# EAGLE schematic tm4cShield_v2.0 (EAGLE 8.0.0)
CNAME: ARL; DESIGNER: Shriya Shah

## Sheet 1 of 2: Power Input, Conditioning
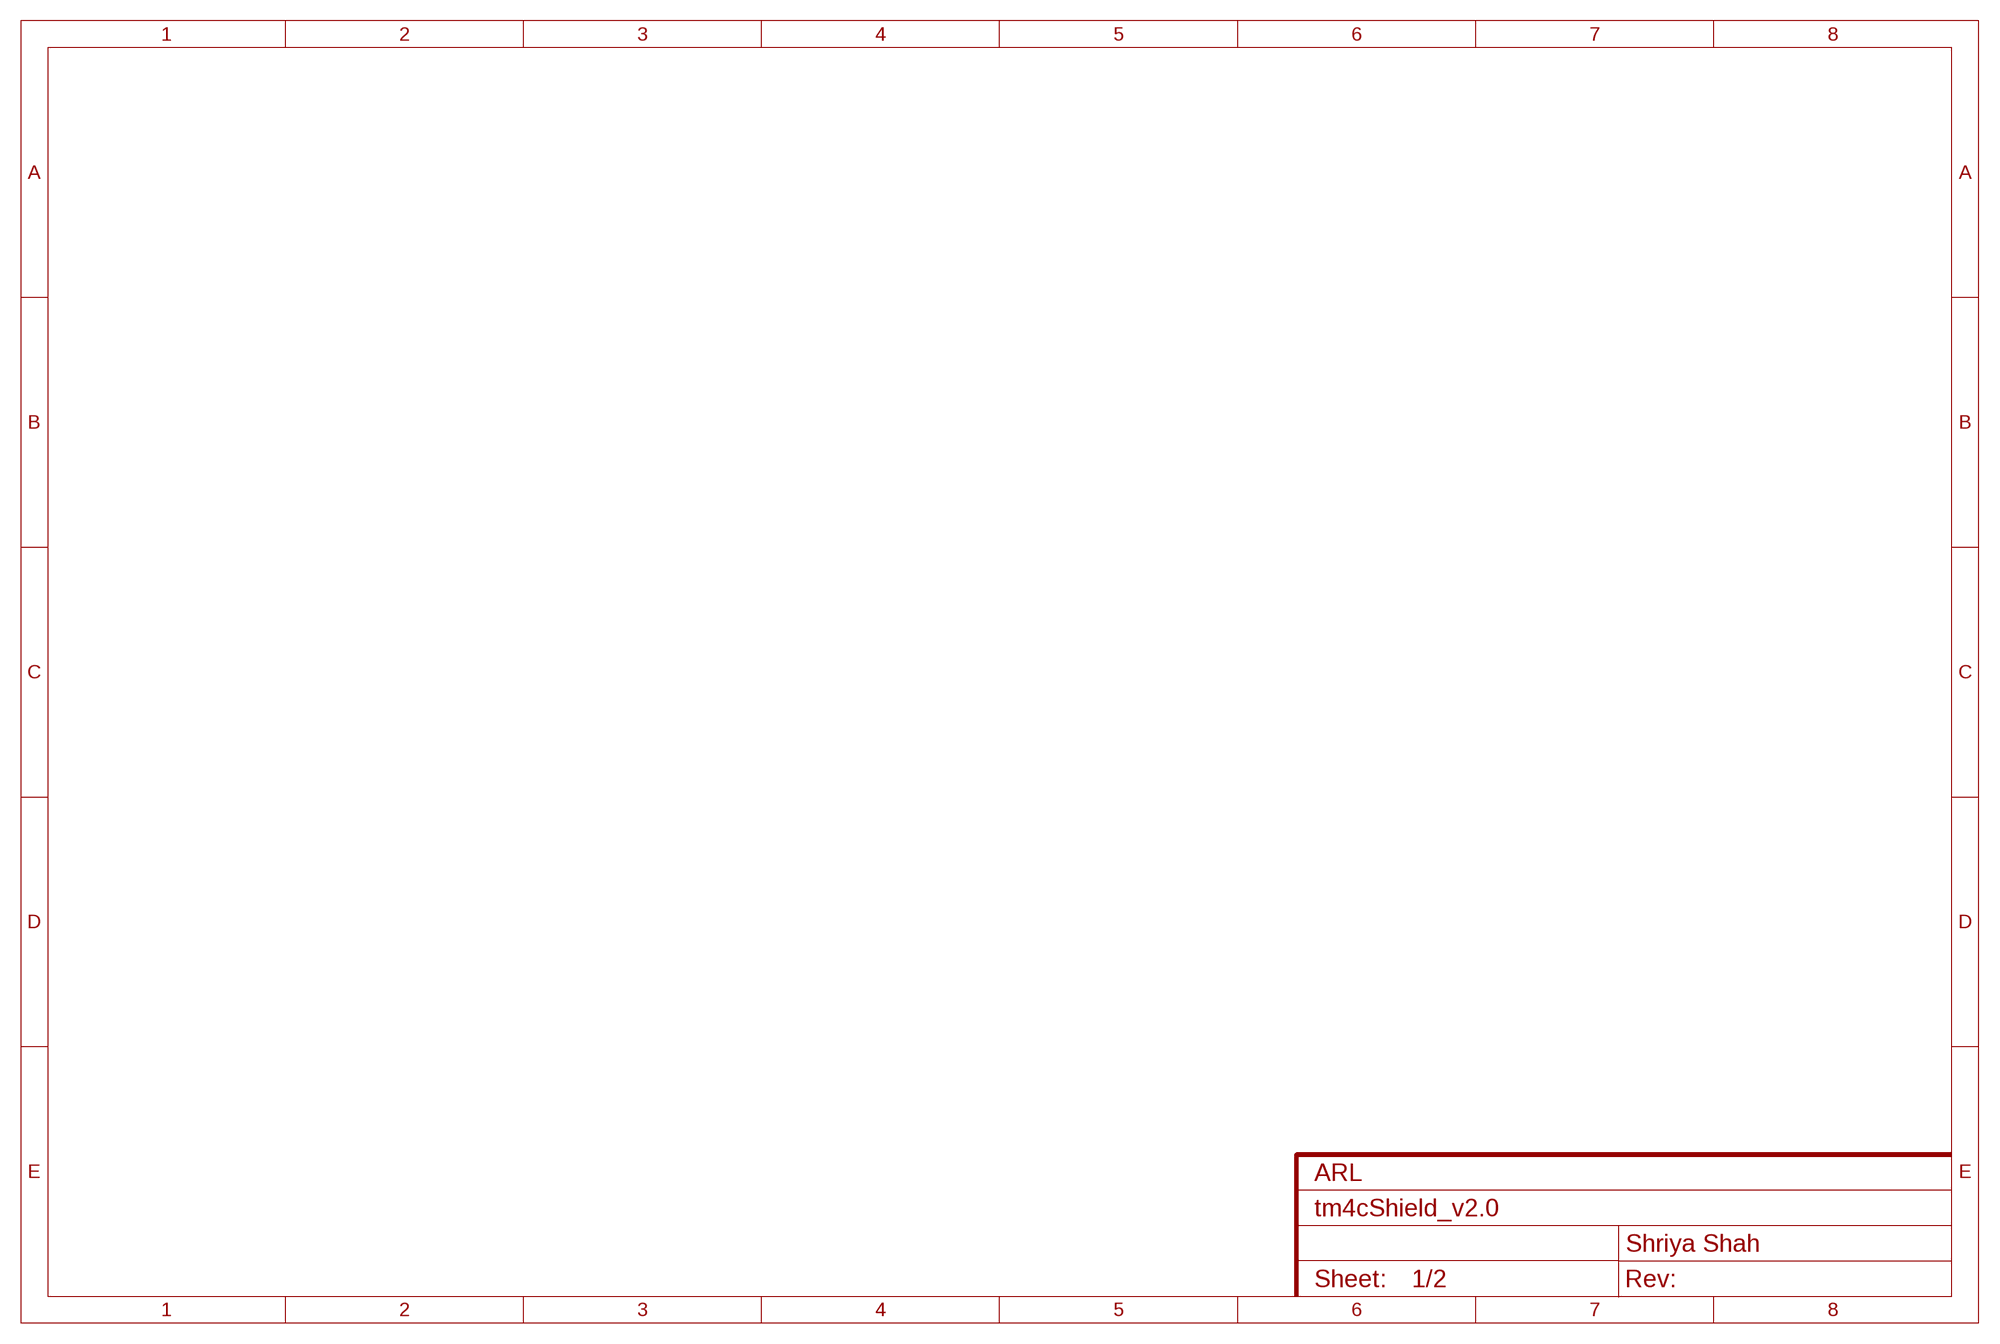
[diagram p0: schematic, sheet 1]

## Sheet 2 of 2
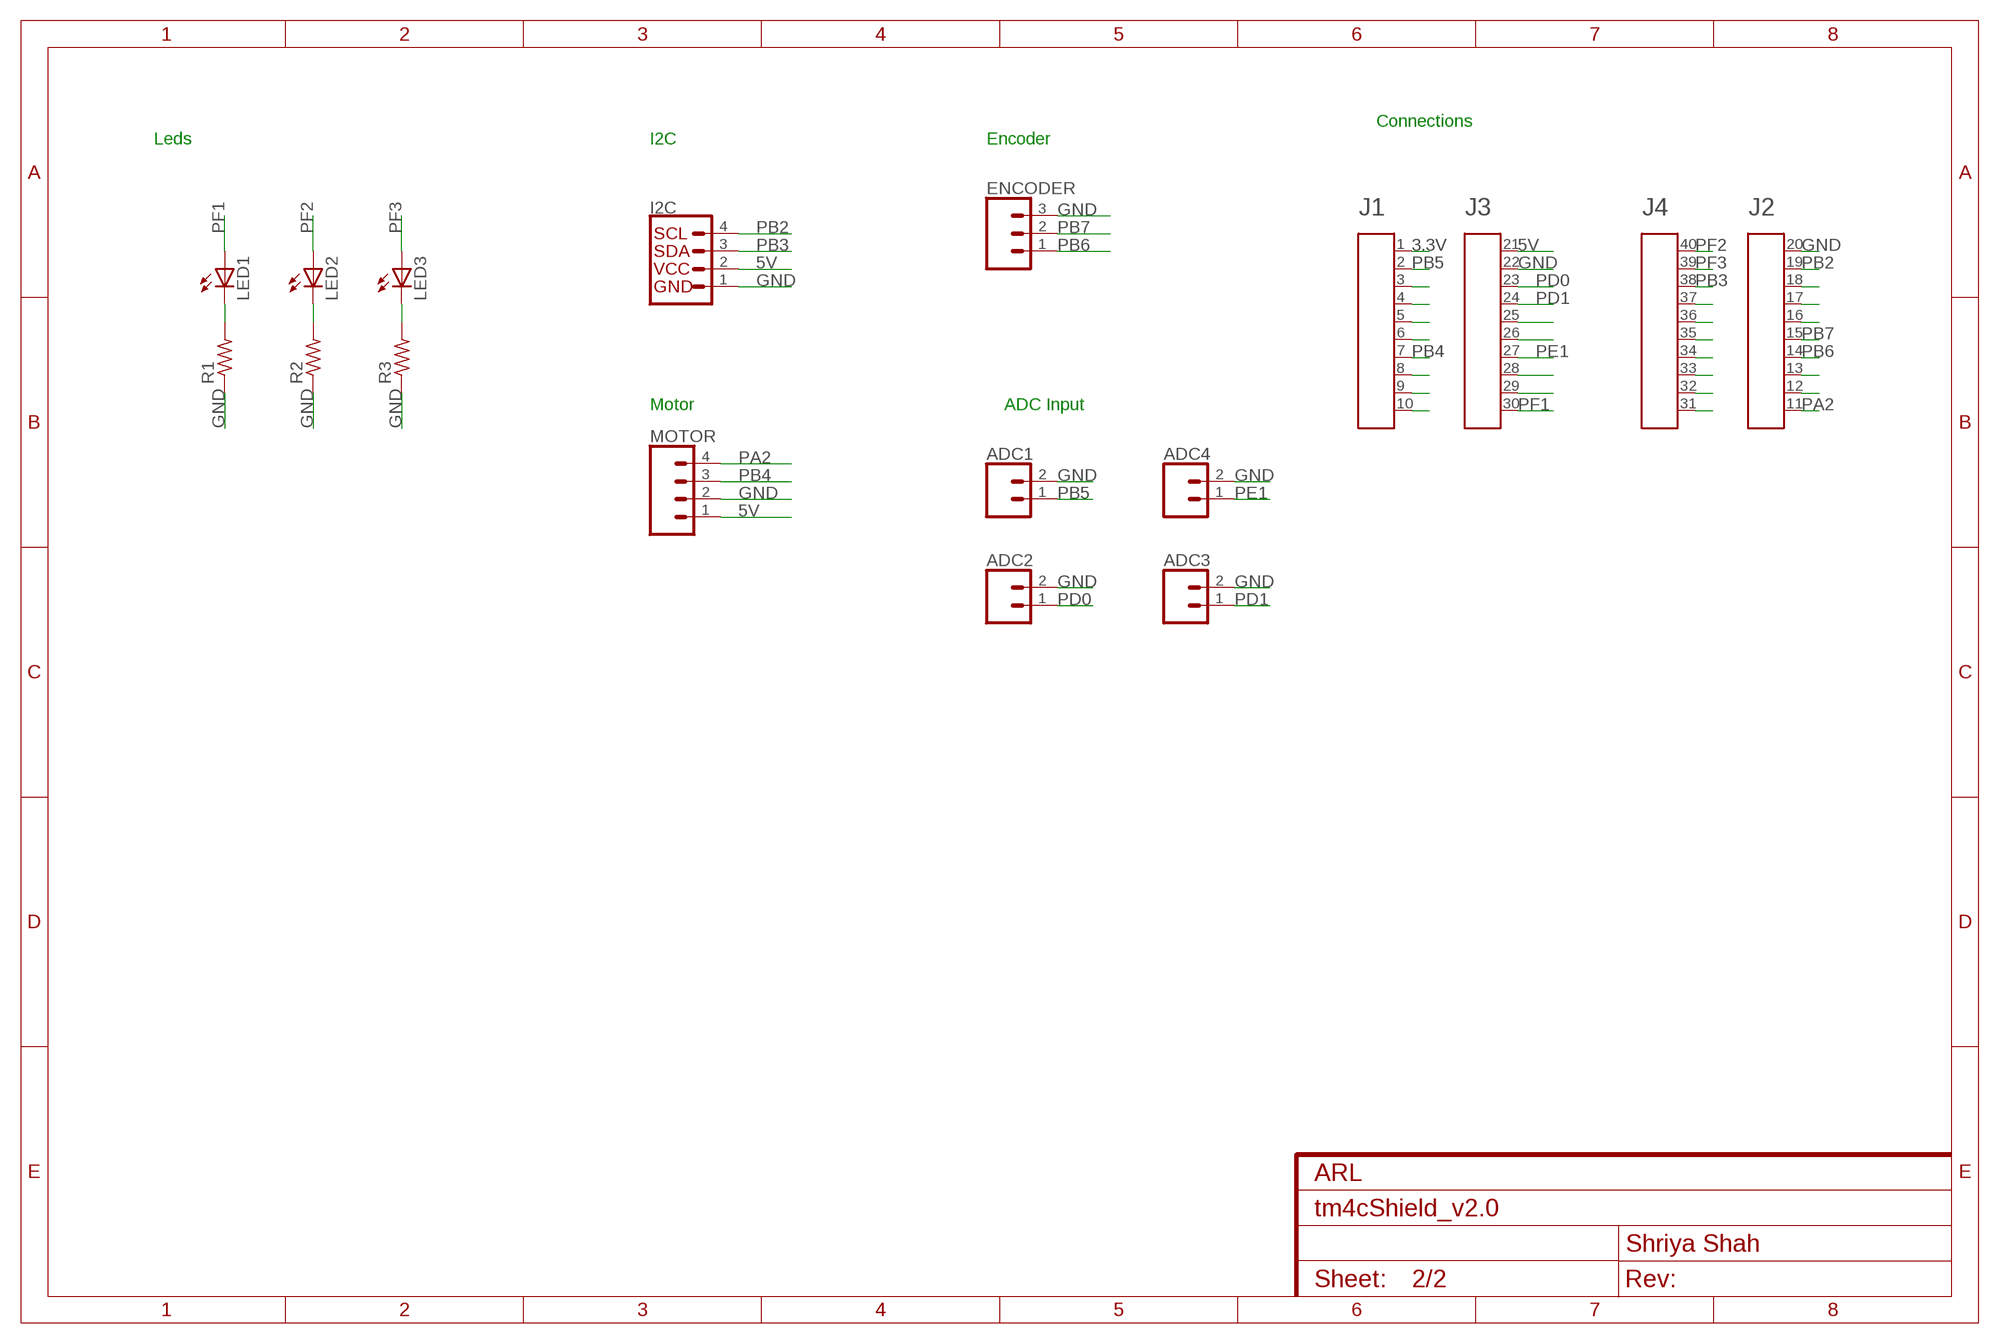
[diagram p1: schematic, sheet 2]

### Parts
A1  HEADER4X10-BOOSTERPACK  [4X10-BOOSTERPACK]
ADC1  CONN_02  [1X02]
ADC2  CONN_02  [1X02]
ADC3  CONN_02  [1X02]
ADC4  CONN_02  [1X02]
ENCODER  CONN_03JST-PTH-VERT  [JST-3-PTH-VERT]
I2C  I2C_STANDARD  [1X04]
LED1  LED0603  [LED-0603]
LED2  LED0603  [LED-0603]
LED3  LED0603  [LED-0603]
MOTOR  CONN_04JST-PTH-VERT  [JST-4-PTH-VERT]
R1  RESISTOR_0603  [RESC0603]
R2  RESISTOR_0603  [RESC0603]
R3  RESISTOR_0603  [RESC0603]

### Nets
3.3V: A1.1
5V: A1.21 I2C.2 MOTOR.1
GND: A1.20 A1.22 ADC1.2 ADC2.2 ADC3.2 ADC4.2 ENCODER.3 I2C.1 MOTOR.2 R1.1 R2.1 R3.1
N$2: LED1.C R1.2
N$4: A1.3
N$5: A1.4
N$6: LED2.C R2.2
N$7: LED3.C R3.2
N$8: A1.5
N$9: A1.6
N$11: A1.8
N$12: A1.9
N$13: A1.10
N$18: A1.25
N$19: A1.26
N$21: A1.28
N$22: A1.29
N$27: A1.37
N$28: A1.36
N$29: A1.35
N$30: A1.34
N$31: A1.33
N$32: A1.32
N$33: A1.31
N$36: A1.18
N$37: A1.17
N$38: A1.16
N$41: A1.13
N$42: A1.12
PA2: A1.11 MOTOR.4
PB2: A1.19 I2C.4
PB3: A1.38 I2C.3
PB4: A1.7 MOTOR.3
PB5: A1.2 ADC1.1
PB6: A1.14 ENCODER.1
PB7: A1.15 ENCODER.2
PD0: A1.23 ADC2.1
PD1: A1.24 ADC3.1
PE1: A1.27 ADC4.1
PF1: A1.30 LED1.A
PF2: A1.40 LED2.A
PF3: A1.39 LED3.A

### Notes on the sheet
- Connections
- Leds | I2C | Encoder
- Motor | ADC Input

## Library data of the parts
A1 = EAGLE_BoosterPack_Library:HEADER4X10-BOOSTERPACK
ADC1-ADC4 = SparkFun-Connectors:CONN_02: Multi connection point. Often used as Generic Header-pin footprint for 0.1 inch spaced/style header connections On any of the 0.1 inch spaced packages, you can populate with these: Break Away Headers - Straight <https://www.sparkfun.com/products/116> (PRT-00116) Break Away Male Headers - Right Angle <https://www.sparkfun.com/products/553> (PRT-00553) Female Headers <https://www.sparkfun.com/products/115> (PRT-00115) Break Away Headers - Machine Pin <https://www.sparkfun.com/products/117> (PRT-00117) Break Away Female Headers - Swiss Machine Pin <https://www.sparkfun.com/products/743> (PRT-00743) For SCREWTERMINALS and SPRING TERMINALS visit here: Screw Terimnals on SparkFun.com <https://www.sparkfun.com/search/results?term=Screw+Terminals> (5mm/3.5mm/2.54mm spacing) This device is also useful as a general connection point to wire up your design to another part of your project. Our various solder wires solder well into these plated through hole pads. Hook-Up Wire - Assortment (Stranded, 22 AWG) <https://www.sparkfun.com/products/11375> (PRT-11375) Hook-Up Wire - Assortment (Solid Core, 22 AWG) <https://www.sparkfun.com/products/11367> (PRT-11367) View the entire wire category on our website here <https://www.sparkfun.com/categories/141> Special notes: Molex polarized connector foot print use with: PRT-08233 with associated crimp pins and housings. 2.54_SCREWTERM for use with PRT-10571. 3.5mm Screw Terminal footprints for PRT-08084 5mm Screw Terminal footprints for use with PRT-08432
ENCODER = SparkFun-Connectors:CONN_03: Multi connection point. Often used as Generic Header-pin footprint for 0.1 inch spaced/style header connections On any of the 0.1 inch spaced packages, you can populate with these: Break Away Headers - Straight <https://www.sparkfun.com/products/116> (PRT-00116) Break Away Male Headers - Right Angle <https://www.sparkfun.com/products/553> (PRT-00553) Female Headers <https://www.sparkfun.com/products/115> (PRT-00115) Break Away Headers - Machine Pin <https://www.sparkfun.com/products/117> (PRT-00117) Break Away Female Headers - Swiss Machine Pin <https://www.sparkfun.com/products/743> (PRT-00743) Stackable Header - 3 Pin (Female, 0.1") <https://www.sparkfun.com/products/13875> (PRT-13875) For SCREWTERMINALS and SPRING TERMINALS visit here: Screw Terimnals on SparkFun.com <https://www.sparkfun.com/search/results?term=Screw+Terminals> (5mm/3.5mm/2.54mm spacing) This device is also useful as a general connection point to wire up your design to another part of your project. Our various solder wires solder well into these plated through hole pads. Hook-Up Wire - Assortment (Stranded, 22 AWG) <https://www.sparkfun.com/products/11375> (PRT-11375) Hook-Up Wire - Assortment (Solid Core, 22 AWG) <https://www.sparkfun.com/products/11367> (PRT-11367) View the entire wire category on our website here <https://www.sparkfun.com/categories/141> Special notes: Molex polarized connector foot print use with SKU : PRT-08232 with associated crimp pins and housings.; PROD_ID: CONN-13230
I2C = SparkFun-Connectors:I2C_STANDARD: SparkFun I2C Standard Pinout Header SparkFun has standardized on a pinout for all I2C based sensor breakouts. This pinout allows I2C boards to be plugged directly into the headers on Arduino Uno compatible boards, and to be daisy chained easily. Example SparkFun Products: SparkFun Atmospheric Sensor Breakout - BME280 <https://www.sparkfun.com/products/13676> SparkFun Altitude/Pressure Sensor Breakout - MPL3115A2 <https://www.sparkfun.com/products/11084> SparkFun TOF Range Finder Sensor - VL6180 <https://www.sparkfun.com/products/12785>
LED1-LED3 = EAGLE_BoosterPack_Library:LED: LEDs Standard schematic elements and footprints for 5mm, 3mm, 1206, and 0603 sized LEDs. 5mm - Spark Fun Electronics SKU : COM-00529 (and others)
MOTOR = SparkFun-Connectors:CONN_04: Multi connection point. Often used as Generic Header-pin footprint for 0.1 inch spaced/style header connections On any of the 0.1 inch spaced packages, you can populate with these: Break Away Headers - Straight <https://www.sparkfun.com/products/116> (PRT-00116) Break Away Male Headers - Right Angle <https://www.sparkfun.com/products/553> (PRT-00553) Female Headers <https://www.sparkfun.com/products/115> (PRT-00115) Break Away Headers - Machine Pin <https://www.sparkfun.com/products/117> (PRT-00117) Break Away Female Headers - Swiss Machine Pin <https://www.sparkfun.com/products/743> (PRT-00743) For SCREWTERMINALS and SPRING TERMINALS visit here: Screw Terimnals on SparkFun.com <https://www.sparkfun.com/search/results?term=Screw+Terminals> (5mm/3.5mm/2.54mm spacing) This device is also useful as a general connection point to wire up your design to another part of your project. Our various solder wires solder well into these plated through hole pads. Hook-Up Wire - Assortment (Stranded, 22 AWG) <https://www.sparkfun.com/products/11375> (PRT-11375) Hook-Up Wire - Assortment (Solid Core, 22 AWG) <https://www.sparkfun.com/products/11367> (PRT-11367) View the entire wire category on our website here <https://www.sparkfun.com/categories/141> Special notes: Molex polarized connector foot print use with SKU : PRT-08231 with associated crimp pins and housings. 1MM SMD Version SKU: PRT-10208; PROD_ID: CONN-13251
R1-R3 = EAGLE_BoosterPack_Library:RESISTOR_